# EAGLE schematic jhon (EAGLE 9.6.2)
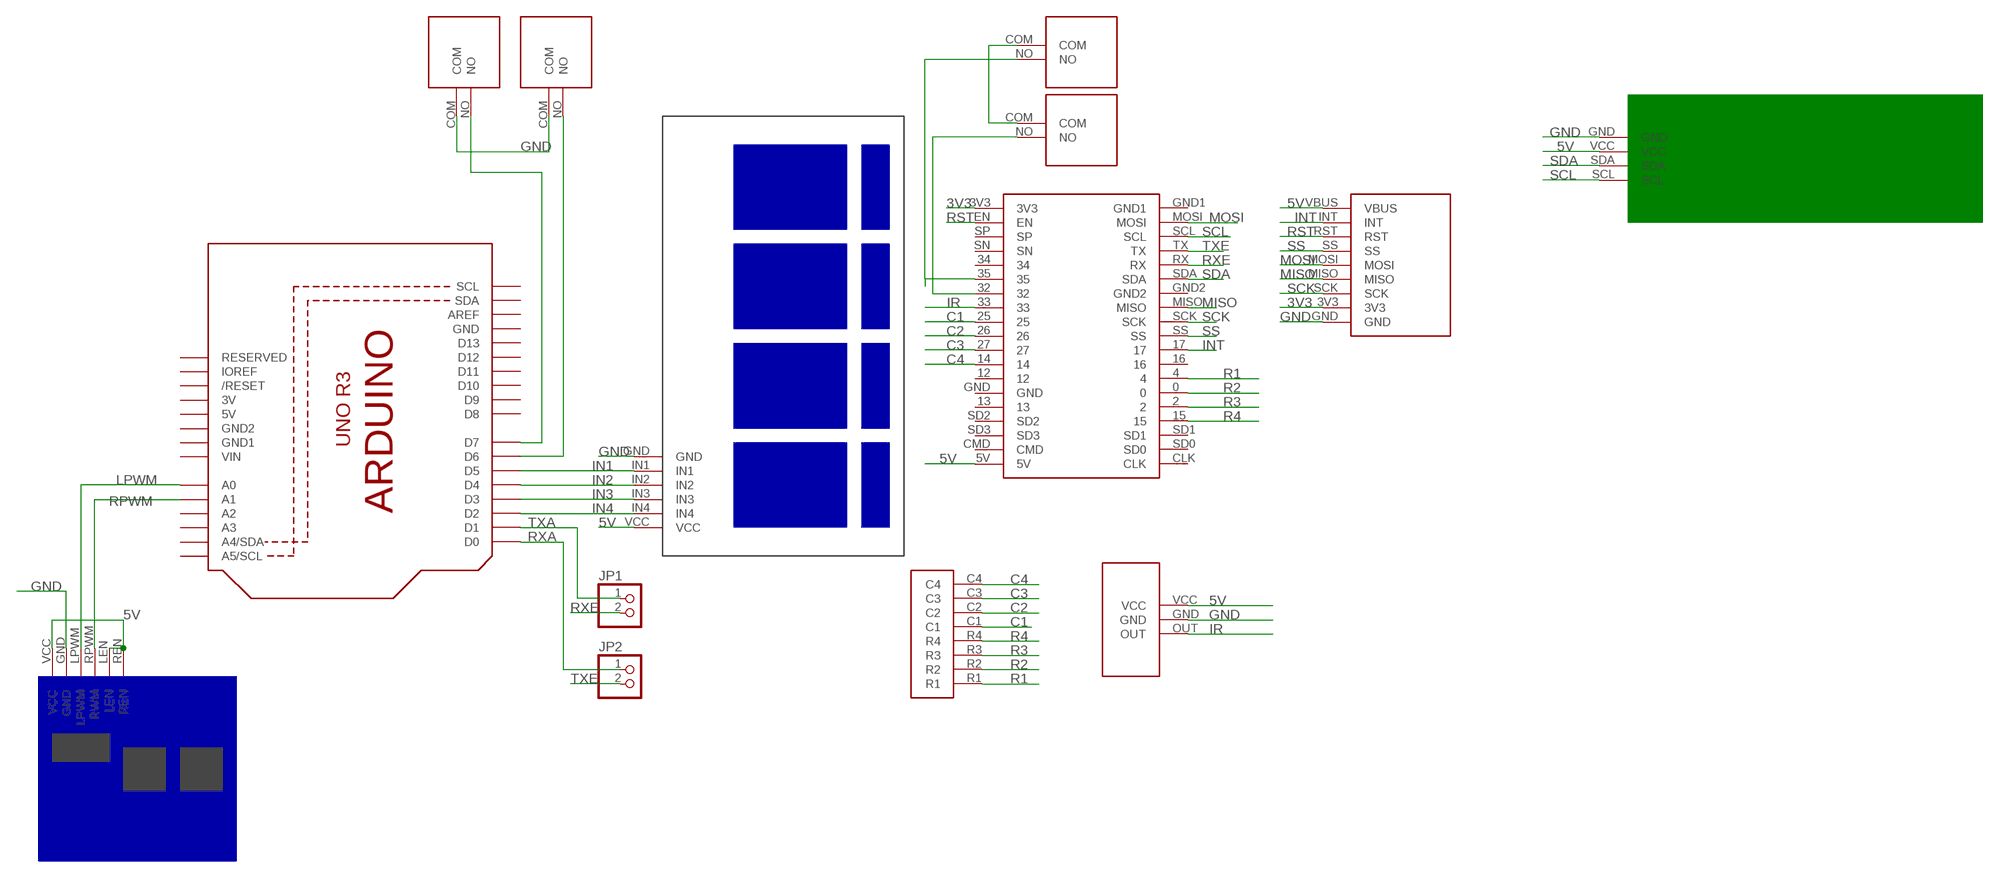
[diagram p0: schematic, sheet 1]

## Parts
JP1  PINHD-1X2  [1X02]
JP2  PINHD-1X2  [1X02]
U$1  ARDUINO_UNO  [ARDUINO_UNO]
U$2  ESP32_38PIN  [ESP32]
U$3  IR_SENSOR  [IR_SENSOR]
U$4  KEYPAD  [KEYPAD]
U$5  LCD_I2C  [LCD_I2C]
U$6  MOTOR_DRIVER_BTS7960  [MOTOR_DRIVER_BTS7960]
U$7  RELAY_4CHANNEL  [RELAY_4CHANNEL]
U$8  SWITCHLIMITER  [SWICHLIMITER]
U$9  SWITCHLIMITER  [SWICHLIMITER]
U$10  SWITCHLIMITER  [SWICHLIMITER]
U$11  SWITCHLIMITER  [SWICHLIMITER]
U$12  USB_HOST_SHIELD_2.0  [USB_HOST_SHIELD_2.0]

## Nets
3V3: U$2.3V3 U$12.3V3
5V: U$2.5V U$3.VCC U$5.VCC U$6.LEN U$6.REN U$6.VCC U$7.VCC U$12.VBUS
C1: U$2.25 U$4.C1
C2: U$2.26 U$4.C2
C3: U$2.27 U$4.C3
C4: U$2.14 U$4.C4
GND: U$3.GND U$5.GND U$6.GND U$7.GND U$10.COM U$11.COM U$12.GND
IN1: U$1.D5 U$7.IN1
IN2: U$1.D4 U$7.IN2
IN3: U$1.D3 U$7.IN3
IN4: U$1.D2 U$7.IN4
INT: U$2.17 U$12.INT
IR: U$2.33 U$3.OUT
LPWM: U$1.A0 U$6.LPWM
MISO: U$2.MISO U$12.MISO
MOSI: U$2.MOSI U$12.MOSI
N$1: U$8.COM U$9.COM
N$2: U$1.D6 U$10.NO
N$3: U$1.D7 U$11.NO
N$4: U$2.32 U$9.NO
N$5: U$2.35 U$8.NO
R1: U$2.4 U$4.R1
R2: U$2.0 U$4.R2
R3: U$2.2 U$4.R3
R4: U$2.15 U$4.R4
RPWM: U$1.A1 U$6.RPWM(RWM)
RST: U$2.EN U$12.RST
RXA: JP2.1 U$1.D0
RXE: JP1.2 U$2.RX
SCK: U$2.SCK U$12.SCK
SCL: U$2.SCL U$5.SCL
SDA: U$2.SDA U$5.SDA
SS: U$2.SS U$12.SS
TXA: JP1.1 U$1.D1
TXE: JP2.2 U$2.TX
Unconnected: U$1.A2 U$1.A3 U$1.A4(A4/SDA) U$1.A5(A5/SCL) U$1.AREF U$1.D8 U$1.D9 U$1.D10 U$1.D11 U$1.D12 U$1.D13 U$1.IOREF U$1.RESERVED U$1.RESET(/RESET) U$1.SCL U$1.SDA U$2.12 U$2.13 U$2.16 U$2.34 U$2.CLK U$2.CMD U$2.GND U$2.GND1 U$2.GND2 U$2.SD0 U$2.SD1 U$2.SD2 U$2.SD3 U$2.SN U$2.SP

## Power pins joined to a net without a drawn wire
3V: U$1.3V
5V: U$1.5V
GND: U$1.GND
GND1: U$1.GND1
GND2: U$1.GND2
VIN: U$1.VIN

## Library data of the parts
JP1 JP2 = pinhead:PINHD-1X2: PIN HEADER
U$1 = LocalLib:ARDUINO_UNO
U$2 = LocalLib:ESP32_38PIN
U$3 = LocalLib:IR_SENSOR
U$4 = LocalLib:KEYPAD
U$5 = LocalLib:LCD_I2C
U$6 = LocalLib:MOTOR_DRIVER_BTS7960
U$7 = LocalLib:RELAY_4CHANNEL
U$8-U$11 = LocalLib:SWITCHLIMITER
U$12 = LocalLib:USB_HOST_SHIELD_2.0